# Altium schematic sheet Connector.SchDoc
size A4
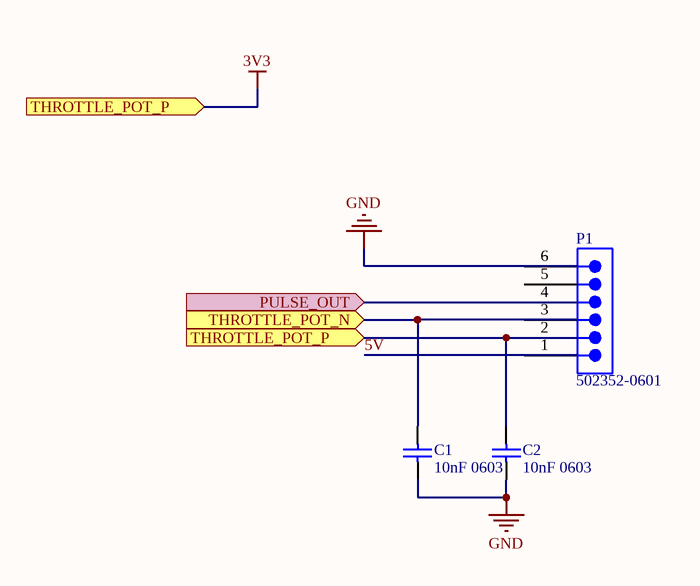
[diagram p0: Connector.SchDoc]

## Parts
C1  10nF 0603  [CAPC0603(1608)100_M]
C2  10nF 0603  [CAPC0603(1608)100_M]
P1  502352-0601  [502352-0601]

## Ports
PULSE_OUT (in), THROTTLE_POT_N (in), THROTTLE_POT_P (in)

## Nets
3V3: C2.2 P1.2 ; port THROTTLE_POT_P
GND: C1.1 C2.1 P1.6
5V: P1.1
PULSE_OUT: P1.4 ; port PULSE_OUT
THROTTLE_POT_N: C1.2 P1.3 ; port THROTTLE_POT_N

Not connected (* = marked no-connect by the designer): P1 5

## Library data of the parts
C1 C2 = CMP-1035-02325-1: CAP 10nF 100V ±10% 0603 (1608 Metric) Thickness 1mm SMD; Case-Metric: 1608; Tolerance: Â±10%; Case-EIA: 0603; Max Thickness: 1 mm; Value: 10nF; Rated Voltage: 100 V; Technology: SMT